# EAGLE design EHcircuit_v2.1 (EAGLE 9.1.0)
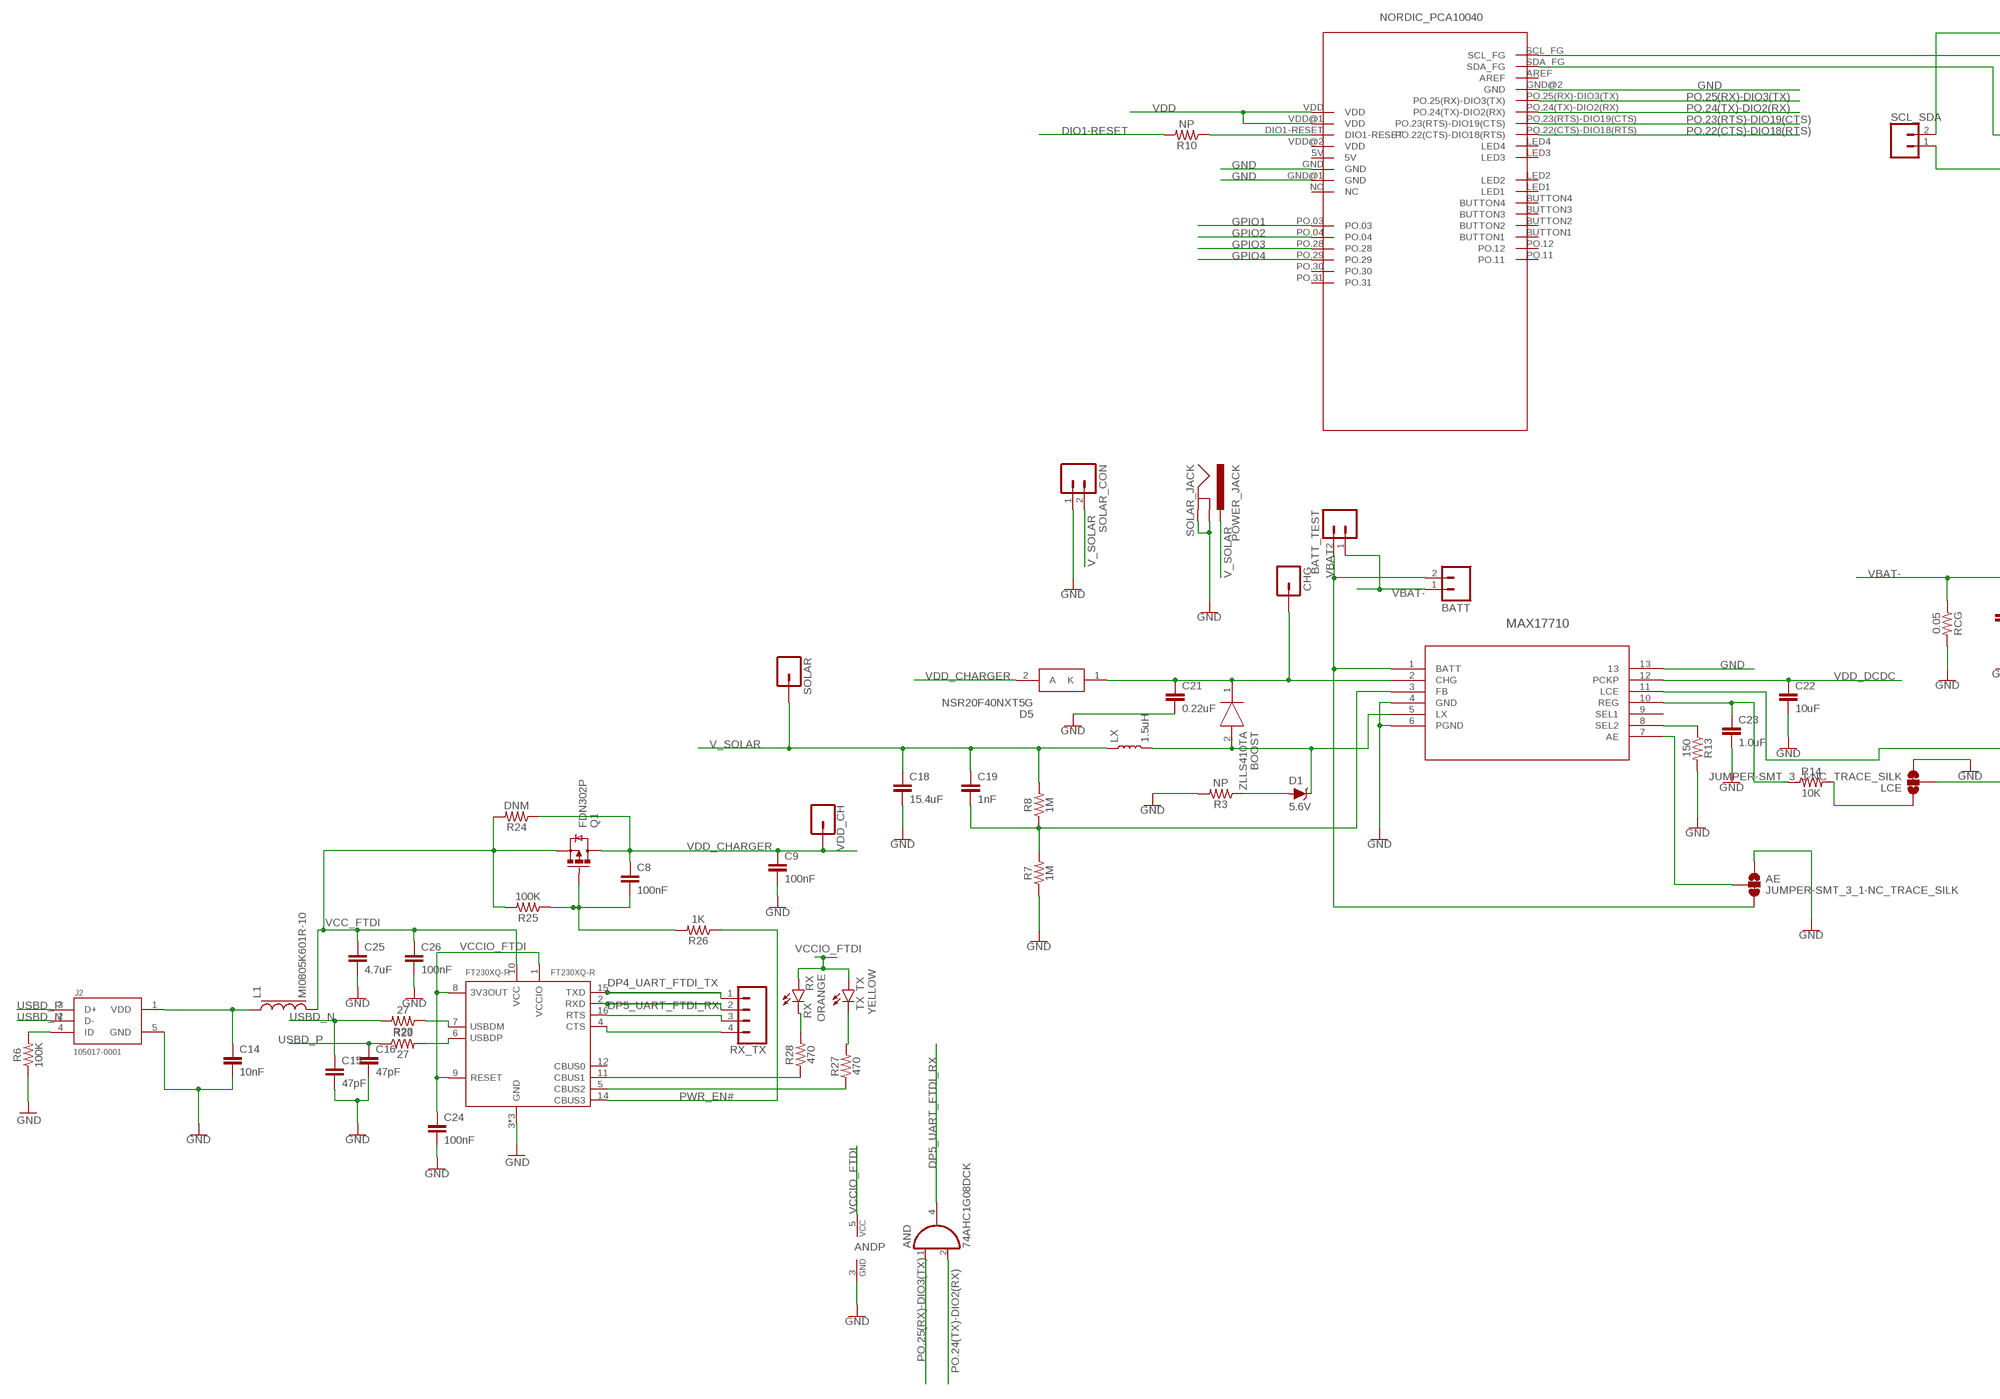
[diagram p0: schematic, sheet 1, part 1 of 2]
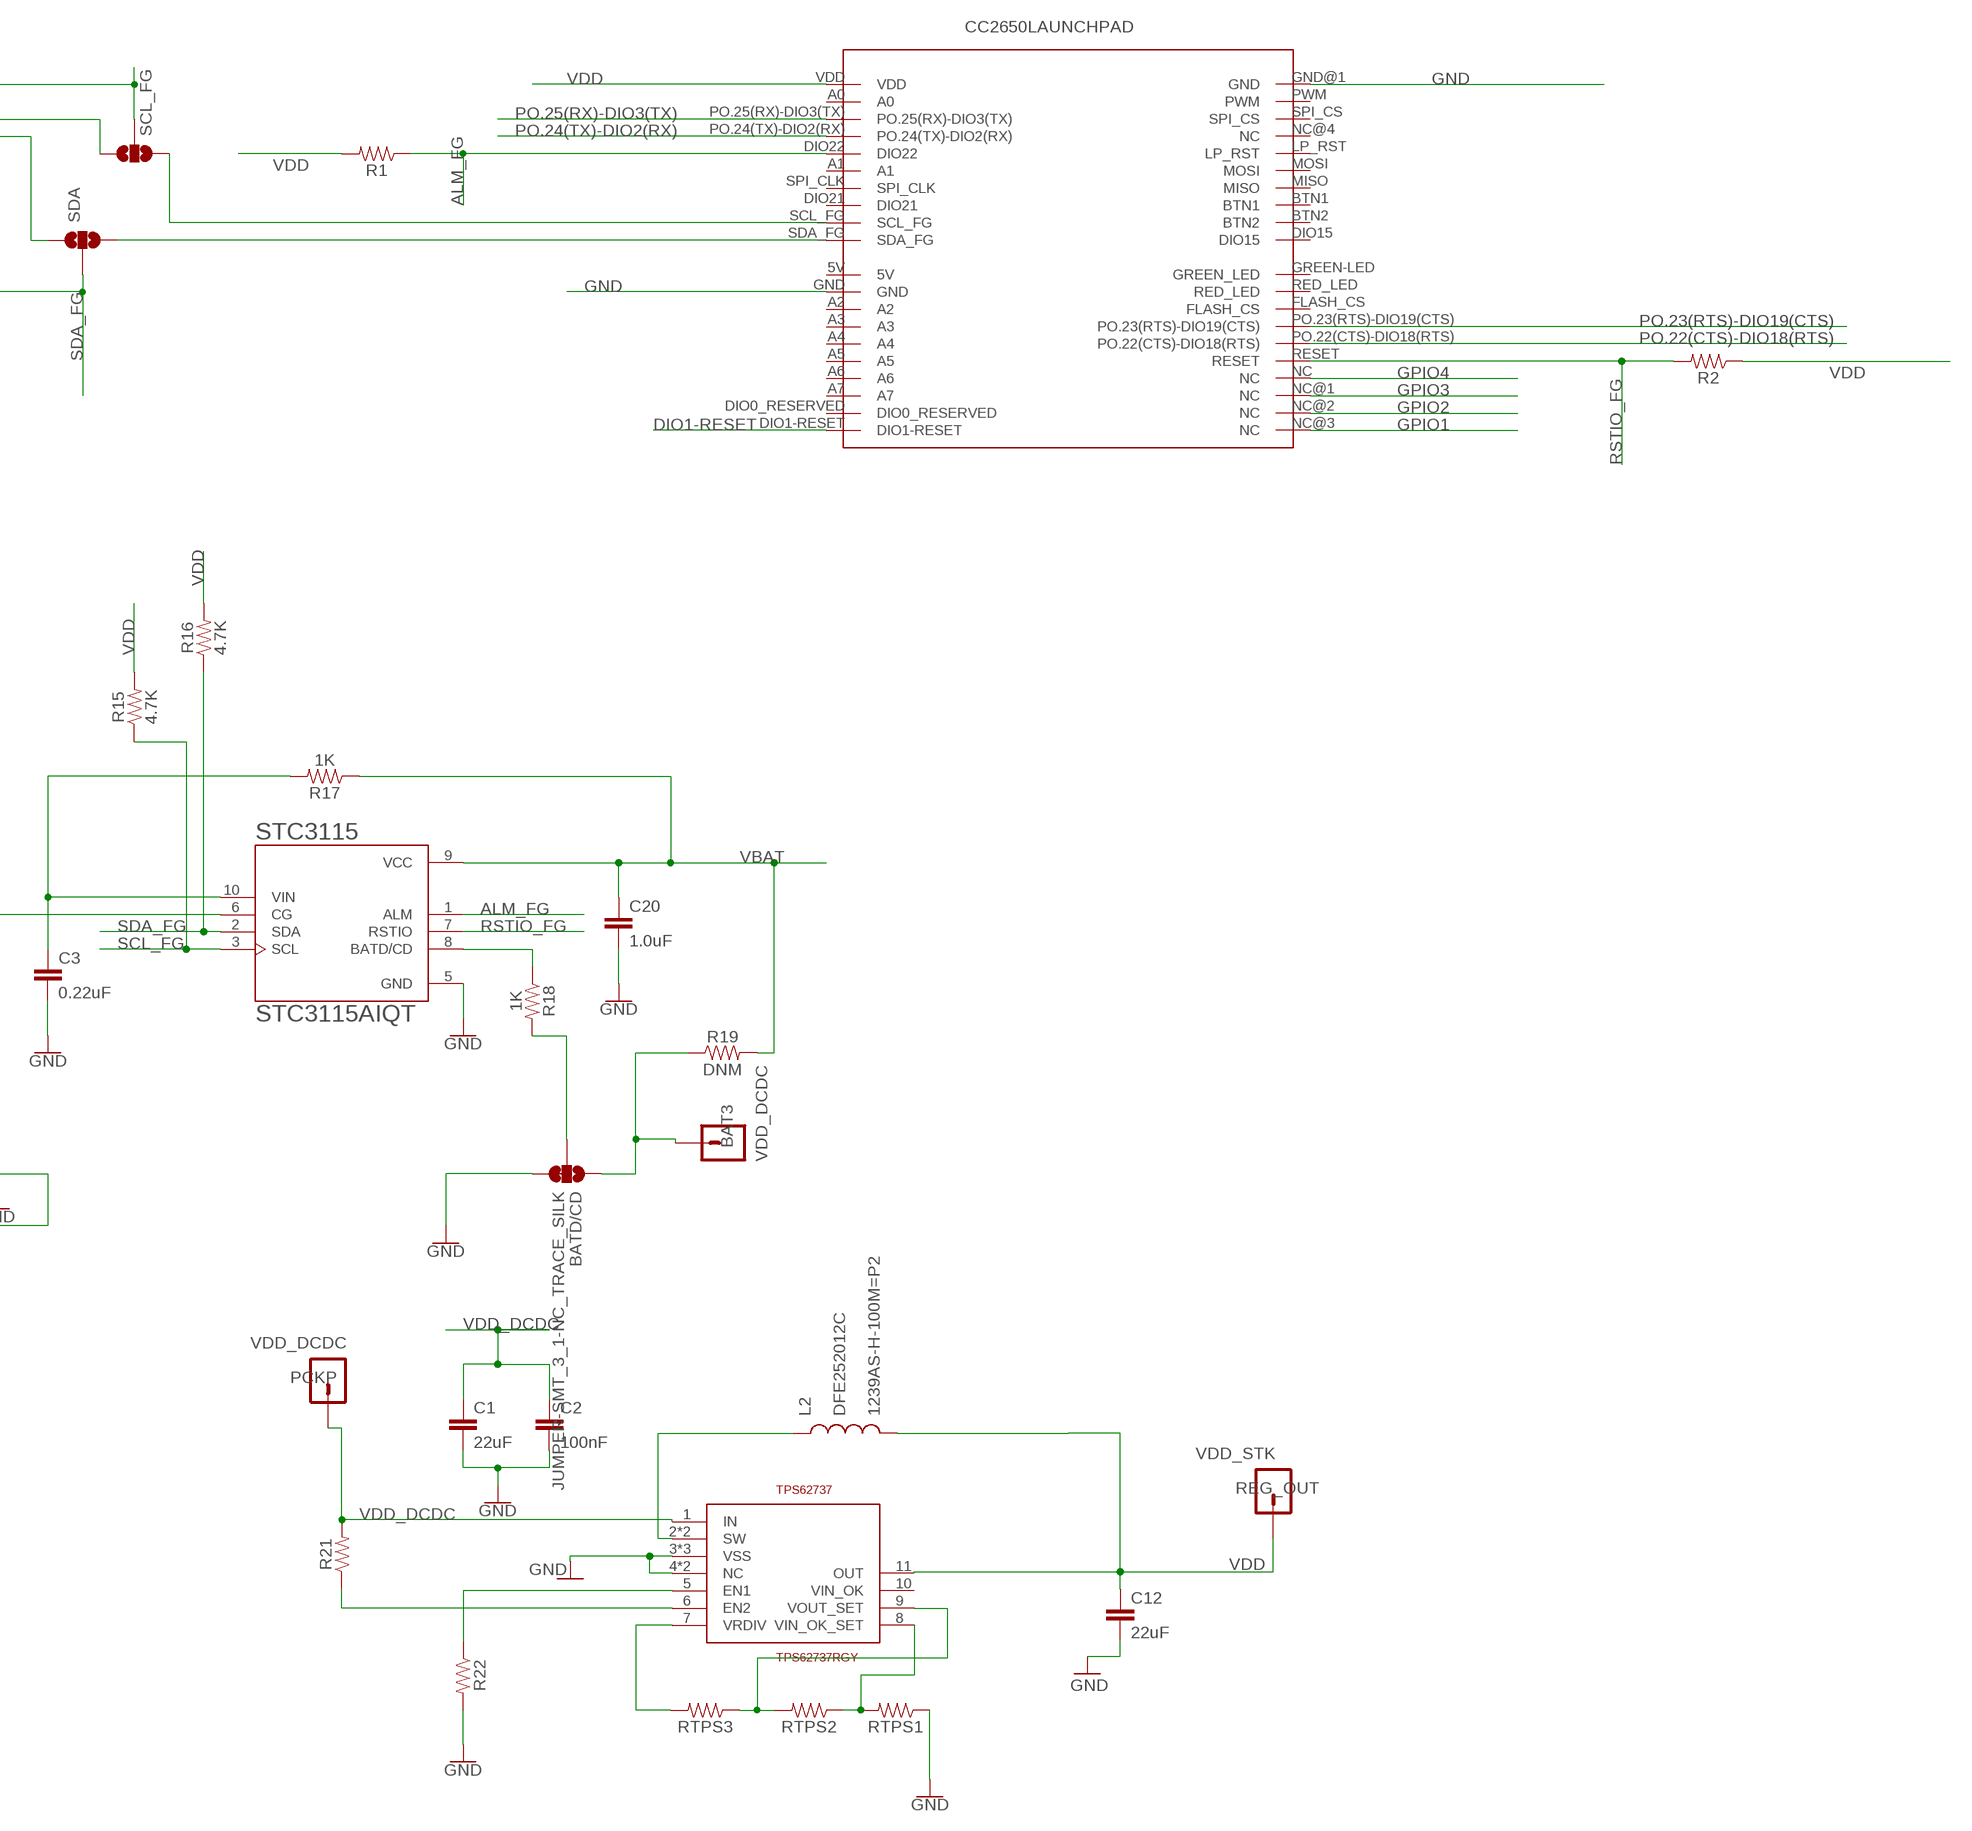
[diagram p1: schematic, sheet 1, part 2 of 2]

## Parts
AE  JUMPER-SMT_3_1-NC_TRACE_SILK  [SMT-JUMPER_3_1-NC_TRACE_SILK]
AND  74AHC1G08DCK  [SC70-5]
BAT3  M01PTH  [1X01@1]
BATD/CD  JUMPER-SMT_3_1-NC_TRACE_SILK  [SMT-JUMPER_3_1-NC_TRACE_SILK]
BATT  M02-JST-2MM-SMT  [JST-2-SMD@1]
BATT_TEST  M02PTH  [1X02@1]
BOOST  ZLLS410TA  [SOD2513X120N]
C1  22uF  10UF-0805-10V-10%  [0805]
C2  100nF  10UF-0805-10V-10%  [0805]
C3  0.22uF  10UF-0805-10V-10%  [0805]
C8  100nF  10UF-0805-10V-10%  [0805]
C9  100nF  10UF-0805-10V-10%  [0805]
C12  22uF  10UF-0805-10V-10%  [0805]
C14  10nF  10UF-0805-10V-10%  [0805]
C15  47pF  10UF-0805-10V-10%  [0805]
C16  47pF  10UF-0805-10V-10%  [0805]
C18  15.4uF  10UF-0805-10V-10%  [0805]
C19  1nF  10UF-0805-10V-10%  [0805]
C20  1.0uF  10UF-0805-10V-10%  [0805]
C21  0.22uF  10UF-0805-10V-10%  [0805]
C22  10uF  10UF-0805-10V-10%  [0805]
C23  1.0uF  10UF-0805-10V-10%  [0805]
C24  100nF  10UF-0805-10V-10%  [0805]
C25  4.7uF  10UF-0805-10V-10%  [0805]
C26  100nF  10UF-0805-10V-10%  [0805]
CHG  M01PTH  [1X01@1]
D1  5.6V  DIODE-ZENER-MMSZ5232BS  [SOD-323]
D5  NSR20F40NXT5G  [DSN2_1]
FT230XQ-R  FT230XQ-R  FT230XQ_2  [QFN16]
J2  105017-0001  [MOLEX_105017-0001]
L1  MI0805K601R-10  FERRITE_BREAD  [0805]
L2  1239AS-H-100M=P2  DFE252012C  [DFE252012C]
LCE  JUMPER-SMT_3_1-NC_TRACE_SILK  [SMT-JUMPER_3_1-NC_TRACE_SILK]
LX  1.5uH  LQM2HPN1R5MG0L  [INDC2520X100]
MAX17710  MAX17710  MAX17710GB+T  [21-0451C]
PCKP  M01PTH  [1X01@1]
Q1  FDN302P  [SOT23-3]
R1  0.3OHM-0805-1/8W-1%  [0805]
R2  0.3OHM-0805-1/8W-1%  [0805]
R3  NP  0.3OHM-0805-1/8W-1%  [0805]
R6  100K  0.3OHM-0805-1/8W-1%  [0805]
R7  1M  0.3OHM-0805-1/8W-1%  [0805]
R8  1M  0.3OHM-0805-1/8W-1%  [0805]
R10  NP  0.3OHM-0805-1/8W-1%  [0805]
R13  150  0.3OHM-0805-1/8W-1%  [0805]
R14  10K  0.3OHM-0805-1/8W-1%  [0805]
R15  4.7K  0.3OHM-0805-1/8W-1%  [0805]
R16  4.7K  0.3OHM-0805-1/8W-1%  [0805]
R17  1K  0.3OHM-0805-1/8W-1%  [0805]
R18  1K  0.3OHM-0805-1/8W-1%  [0805]
R19  DNM  0.3OHM-0805-1/8W-1%  [0805]
R21  0.3OHM-0805-1/8W-1%  [0805]
R22  0.3OHM-0805-1/8W-1%  [0805]
R23  27  0.3OHM-0805-1/8W-1%  [0805]
R24  DNM  0.3OHM-0805-1/8W-1%  [0805]
R25  100K  0.3OHM-0805-1/8W-1%  [0805]
R26  1K  0.3OHM-0805-1/8W-1%  [0805]
R27  470  0.3OHM-0805-1/8W-1%  [0805]
R28  470  0.3OHM-0805-1/8W-1%  [0805]
R29  27  0.3OHM-0805-1/8W-1%  [0805]
RB2  CC2650LAUNCHPAD  [SEPS_RB]
RCG  0.05  0.3OHM-0805-1/8W-1%  [0805]
REG_OUT  M01PTH  [1X01@1]
RTPS1  0.3OHM-0805-1/8W-1%  [0805]
RTPS2  0.3OHM-0805-1/8W-1%  [0805]
RTPS3  0.3OHM-0805-1/8W-1%  [0805]
RX  ORANGE  LED0603  [LED-0603]
RX_TX  CONN_04  [1X04]
SCL  JUMPER-SMT_3_0_SILK  [SMT-JUMPER_3_0_NC_TRACE_SILK]
SCL_SDA  CONN_02  [1X02]
SDA  JUMPER-SMT_3_0_SILK  [SMT-JUMPER_3_0_NC_TRACE_SILK]
SOLAR  M01PTH  [1X01@1]
SOLAR_CON  M023.5MM  [SCREWTERMINAL-3.5MM-2@1]
SOLAR_JACK  POWER_JACK  [POWER_JACK_PTH]
STC3115  STC3115AIQT  [SON50P200X300X60-10]
TPS62737  TPS62737RGY  [QFN14]
TX  YELLOW  LED0603  [LED-0603]
U$1  PCA10040NORDIC  [SEPS_BB]
VDD_CH  CONN_01  [1X01]

## Nets
ALM_FG: R1.1 RB2.DIO22 STC3115.1(ALM)
DIO1-RESET: R10.2 RB2.DIO1-RESET
DP4_UART_FTDI_TX: FT230XQ-R.15(TXD) RX_TX.1
DP5_UART_FTDI_RX: AND.4(O) FT230XQ-R.2(RXD) RX_TX.2
GND: AE.1 AND.3(GND) BATD/CD.3 C1.2 C2.2 C3.2 C9.2 C12.2 C14.2 C15.2 C16.2 C18.2 C20.2 C21.2 C22.2 C23.2 C24.2 C25.2 C26.2 FT230XQ-R.3(GND) FT230XQ-R.13(GND) FT230XQ-R.17(GND) J2.5(GND) LCE.3 MAX17710.4(GND) MAX17710.6(PGND) MAX17710.13 R3.2 R6.1 R7.1 R13.2 R22.2 RB2.GND RB2.GND@1(GND) RCG.2 RTPS1.1 SOLAR_CON.1 SOLAR_JACK.GND SOLAR_JACK.GNDBREAK STC3115.5(GND) TPS62737.3(VSS) TPS62737.4(NC) TPS62737.12(VSS) TPS62737.14(NC) TPS62737.TH_PAD(VSS) U$1.GND U$1.GND@1(GND) U$1.GND@2(GND)
GPIO1: RB2.NC@3(NC) U$1.PO.03
GPIO2: RB2.NC@2(NC) U$1.PO.04
GPIO3: RB2.NC@1(NC) U$1.PO.28
GPIO4: RB2.NC U$1.PO.29
N$1: FT230XQ-R.11(CBUS1) R28.1
N$2: C14.1 J2.1(VDD) L1.1
N$3: C8.2 Q1.1(G) R25.1 R26.2
N$4: RTPS1.2 RTPS2.1 TPS62737.8(VIN_OK_SET)
N$5: R18.1 STC3115.8(BATD/CD)
N$6: R22.1 TPS62737.5(EN1)
N$7: BOOST.2(A) D1.C LX.2 MAX17710.5(LX)
N$9: C19.2 MAX17710.3(FB) R7.2 R8.1
N$10: R21.1 TPS62737.6(EN2)
N$11: L2.P$1 TPS62737.2(SW) TPS62737.13(SW)
N$12: RB2.SCL_FG SCL.1
N$13: C23.1 MAX17710.10(REG) R14.1
N$14: FT230XQ-R.5(CBUS2) R27.1
N$15: LCE.2 MAX17710.11(LCE)
N$16: MAX17710.8(SEL2) R13.1
N$17: LCE.1 R14.2
N$18: J2.4(ID) R6.2
N$19: AE.2 MAX17710.7(AE)
N$20: R28.2 RX.C
N$21: R10.1 U$1.DIO1-RESET
N$22: RTPS3.2 TPS62737.7(VRDIV)
N$23: RB2.SDA_FG SDA.3
N$24: R27.2 TX.C
N$25: BATD/CD.2 R18.2
N$26: RTPS2.2 RTPS3.1 TPS62737.9(VOUT_SET)
N$27: SDA.1 U$1.SDA_FG
N$28: SCL.3 U$1.SCL_FG
N$29: BAT3.1 BATD/CD.1 R19.1
N$30: BOOST.1(K) C21.1 CHG.1 D5.1(K) MAX17710.2(CHG)
N$31: FT230XQ-R.7(USBDM) R23.1
N$32: FT230XQ-R.6(USBDP) R29.2
N$33: FT230XQ-R.16(RTS) RX_TX.3
N$34: C3.1 R17.2 STC3115.10(VIN)
N$35: FT230XQ-R.4(CTS) RX_TX.4
N$36: D1.A R3.1
PO.22(CTS)-DIO18(RTS): RB2.PO.22(CTS)-DIO18(RTS) U$1.PO.22(CTS)-DIO18(RTS)
PO.23(RTS)-DIO19(CTS): RB2.PO.23(RTS)-DIO19(CTS) U$1.PO.23(RTS)-DIO19(CTS)
PO.24(TX)-DIO2(RX): AND.2(I1) RB2.PO.24(TX)-DIO2(RX) U$1.PO.24(TX)-DIO2(RX)
PO.25(RX)-DIO3(TX): AND.1(I0) RB2.PO.25(RX)-DIO3(TX) U$1.PO.25(RX)-DIO3(TX)
PWR_EN#: FT230XQ-R.14(CBUS3) R26.1
RSTIO_FG: R2.2 RB2.RESET STC3115.7(RSTIO)
SCL_FG: R15.1 SCL.2 SCL_SDA.2 STC3115.3(SCL)
SDA_FG: R16.1 SCL_SDA.1 SDA.2 STC3115.2(SDA)
USBD_N: C15.1 J2.2(D-) R23.2
USBD_P: C16.1 J2.3(D+) R29.1
V_SOLAR: C18.1 C19.1 LX.1 R8.2 SOLAR.1 SOLAR_CON.2 SOLAR_JACK.PWR
VBAT: AE.3 BATT.2 BATT_TEST.2 C20.1 MAX17710.1(BATT) R17.1 R19.2 STC3115.9(VCC)
VBAT-: BATT.1 BATT_TEST.1 RCG.1 STC3115.6(CG)
VCC_FTDI: C25.1 C26.1 FT230XQ-R.10(VCC) L1.2 Q1.2(S) R24.2 R25.2
VCCIO_FTDI: AND.5(VCC) C24.1 FT230XQ-R.1(VCCIO) FT230XQ-R.8(3V3OUT) FT230XQ-R.9(RESET) RX.A TX.A
VDD: C12.1 L2.P$2 R1.2 R2.1 R15.2 R16.2 RB2.VDD REG_OUT.1 TPS62737.11(OUT) U$1.VDD U$1.VDD@1(VDD)
VDD_CHARGER: C8.1 C9.1 D5.2(A) Q1.3(D) R24.1 VDD_CH.1
VDD_DCDC: C1.1 C2.1 C22.1 MAX17710.12(PCKP) PCKP.1 R21.2 TPS62737.1(IN)
Unconnected: FT230XQ-R.12(CBUS0) MAX17710.9(SEL1) RB2.5V RB2.A0 RB2.A1 RB2.A2 RB2.A3 RB2.A4 RB2.A5 RB2.A6 RB2.A7 RB2.BTN1 RB2.BTN2 RB2.DIO0_RESERVED RB2.DIO15 RB2.DIO21 RB2.FLASH_CS RB2.GREEN-LED(GREEN_LED) RB2.LP_RST RB2.MISO RB2.MOSI RB2.NC@4(NC) RB2.PWM RB2.RED_LED RB2.SPI_CLK RB2.SPI_CS TPS62737.10(VIN_OK) U$1.5V U$1.AREF U$1.BUTTON1 U$1.BUTTON2 U$1.BUTTON3 U$1.BUTTON4 U$1.LED1 U$1.LED2 U$1.LED3 U$1.LED4 U$1.NC U$1.PO.11 U$1.PO.12 U$1.PO.30 U$1.PO.31 U$1.VDD@2(VDD)

## Library data of the parts
AE BATD/CD LCE = SparkFun-Jumpers:JUMPER-SMT_3_1-NC_TRACE: Normally closed trace jumper (1 of 2 connections) This jumper has a trace between two pads so it's normally closed (NC). The other connection is normally open (NO). Use a razor knife to open the connection. For best results follow the IPC guidelines for cutting traces: Cutout at least 0.063 mm (0.005 in). Remove all loose material to clean up the cut area. Seal the cut with an approved epoxy. Reapply solder to reclose the connection, or to close the NO connection.
AND = 74xx-little-de:74*1G08: 2-input AND gate
BAT3 PCKP = SparkFun-Connectors:M01: Header 1 Standard 1-pin 0.1" header. Use with straight break away headers (SKU : PRT-00116), right angle break away headers (PRT-00553), swiss pins (PRT-00743), machine pins (PRT-00117), and female headers (PRT-00115). SMTSO-256-ET is a "flush mount" nut for a 4-40 screw. The older package used to be too tight, and did not allow it to sit properly thru the drill hit. The latest (0.165DIA) fits nice and snug.; LABEL: VDD_DCDC
BATT = SparkFun-Connectors:M02: Standard 2-pin 0.1" header. Use with - straight break away headers ( PRT-00116) - right angle break away headers (PRT-00553) - swiss pins (PRT-00743) - machine pins (PRT-00117) - female headers (PRT-00115) Molex polarized connector foot print use with: PRT-08233 with associated crimp pins and housings. 2.54_SCREWTERM for use with PRT-10571. 3.5mm Screw Terminal footprints for PRT-08084 5mm Screw Terminal footprints for use with PRT-08432; PROD_ID: CONN-11443
BATT_TEST = SparkFun-Connectors:M02: Standard 2-pin 0.1" header. Use with - straight break away headers ( PRT-00116) - right angle break away headers (PRT-00553) - swiss pins (PRT-00743) - machine pins (PRT-00117) - female headers (PRT-00115) Molex polarized connector foot print use with: PRT-08233 with associated crimp pins and housings. 2.54_SCREWTERM for use with PRT-10571. 3.5mm Screw Terminal footprints for PRT-08084 5mm Screw Terminal footprints for use with PRT-08432
BOOST = ZLLS410TA:ZLLS410TA: Diodes Inc ZLLS410TA, SMT Schottky Diode, 10V 750mA, 3ns, 2-Pin SOD-323 Source: Datasheet <http://uk.rs-online.com/web/p/products/1221249>; ARROW_PART_NUMBER: ZLLS410TA; ARROW_PRICE/STOCK: https://www.arrow.com/en/products/zlls410ta/diodes-incorporated; DESCRIPTION: Diodes Inc ZLLS410TA, SMT Schottky Diode, 10V 750mA, 3ns, 2-Pin SOD-323; HEIGHT: 1.2mm; MANUFACTURER_NAME: Diodes Inc.; MANUFACTURER_PART_NUMBER: ZLLS410TA; RS_PART_NUMBER: 1221249; RS_PRICE/STOCK: http://uk.rs-online.com/web/p/products/1221249
C1-C3 C8 C9 C12 C14-C16 C18-C21 C23-C26 = SparkFun-Capacitors:10UF: 10.0µF ceramic capacitors A capacitor is a passive two-terminal electrical component used to store electrical energy temporarily in an electric field.; PROD_ID: CAP-11330; VALUE: 10uF
C22 = SparkFun-Capacitors:10UF: 10.0µF ceramic capacitors A capacitor is a passive two-terminal electrical component used to store electrical energy temporarily in an electric field.; PROD_ID: CAP-11330
CHG SOLAR = SparkFun-Connectors:M01: Header 1 Standard 1-pin 0.1" header. Use with straight break away headers (SKU : PRT-00116), right angle break away headers (PRT-00553), swiss pins (PRT-00743), machine pins (PRT-00117), and female headers (PRT-00115). SMTSO-256-ET is a "flush mount" nut for a 4-40 screw. The older package used to be too tight, and did not allow it to sit properly thru the drill hit. The latest (0.165DIA) fits nice and snug.
D1 = SparkFun-DiscreteSemi:DIODE-ZENER: Zener Diode A Zener diode allows current to flow from its anode to its cathode like a normal semiconductor diode, but it also permits current to flow in the reverse direction when its "Zener voltage" is reached. - WIkipedia; PROD_ID: DIO-12442
D5 = NSR20F40NXT5G:NSR20F40NXT5G: DSN2 0603 Schottky Diode 40V 2A Source: Datasheet <http://www.onsemi.com/pub/Collateral/NSR20F40-D.PDF>; ARROW_PART_NUMBER: NSR20F40NXT5G; ARROW_PRICE/STOCK: https://www.arrow.com/en/products/nsr20f40nxt5g/on-semiconductor; DESCRIPTION: DSN2 0603 Schottky Diode 40V 2A; HEIGHT: mm; MANUFACTURER_NAME: ON Semiconductor; MANUFACTURER_PART_NUMBER: NSR20F40NXT5G
FT230XQ-R = FT230XQ:FT230XQ_2
J2 = 105017-0001:105017-0001; AVAILABILITY: Good; DESCRIPTION: Conn USB Type B M 5 POS 0.65mm Solder RA Thru-Hole 5 Terminal 1 Port Embossed T/R; MF: Molex; MP: 105017-0001; PACKAGE: None; PRICE: 0.49 USD
L1 = davide:FERRITE_BREAD
L2 = davide:DFE252012C; MODEL: DFE252012C
LX = INDC2520X100:LQM2HPN1R5MG0L: Inductor Murata Electronics North America LQM2HPN1R5MG0L‎
MAX17710 = MAX17710:MAX17710GB+T; MANUFACTURER_NAME: Maxi17710; MANUFACTURER_PART_NUMBER: MAX17710GB+T; VENDOR: Maxim
Q1 = davide:FDN302P
R1-R3 R6-R8 R10 R13-R19 R21-R29 RCG RTPS1-RTPS3 = SparkFun-Resistors:0.3OHM: 0.3Ω resistor A resistor is a passive two-terminal electrical component that implements electrical resistance as a circuit element. Resistors act to reduce current flow, and, at the same time, act to lower voltage levels within circuits. - Wikipedia; PROD_ID: RES-11622; VALUE: 0.3
RB2 = powersol:CC2650LAUNCHPAD: CC2650 LaunchPad
REG_OUT = SparkFun-Connectors:M01: Header 1 Standard 1-pin 0.1" header. Use with straight break away headers (SKU : PRT-00116), right angle break away headers (PRT-00553), swiss pins (PRT-00743), machine pins (PRT-00117), and female headers (PRT-00115). SMTSO-256-ET is a "flush mount" nut for a 4-40 screw. The older package used to be too tight, and did not allow it to sit properly thru the drill hit. The latest (0.165DIA) fits nice and snug.; LABEL: VDD_STK
RX = SparkFun-LED:LED: LED (Generic) Standard schematic elements and footprints for 5mm, 3mm, 1206, and 0603 sized LEDs. Generic LEDs with no color specified.; COLOR: ORANGE; FUNCTION: RX
RX_TX = SparkFun-Connectors:CONN_04: Multi connection point. Often used as Generic Header-pin footprint for 0.1 inch spaced/style header connections On any of the 0.1 inch spaced packages, you can populate with these: Break Away Headers - Straight <https://www.sparkfun.com/products/116> (PRT-00116) Break Away Male Headers - Right Angle <https://www.sparkfun.com/products/553> (PRT-00553) Female Headers <https://www.sparkfun.com/products/115> (PRT-00115) Break Away Headers - Machine Pin <https://www.sparkfun.com/products/117> (PRT-00117) Break Away Female Headers - Swiss Machine Pin <https://www.sparkfun.com/products/743> (PRT-00743) For SCREWTERMINALS and SPRING TERMINALS visit here: Screw Terimnals on SparkFun.com <https://www.sparkfun.com/search/results?term=Screw+Terminals> (5mm/3.5mm/2.54mm spacing) This device is also useful as a general connection point to wire up your design to another part of your project. Our various solder wires solder well into these plated through hole pads. Hook-Up Wire - Assortment (Stranded, 22 AWG) <https://www.sparkfun.com/products/11375> (PRT-11375) Hook-Up Wire - Assortment (Solid Core, 22 AWG) <https://www.sparkfun.com/products/11367> (PRT-11367) View the entire wire category on our website here <https://www.sparkfun.com/categories/141> Special notes: Molex polarized connector foot print use with SKU : PRT-08231 with associated crimp pins and housings. 1MM SMD Version SKU: PRT-10208; PROD_ID: CONN-09696
SCL SDA = powersol:JUMPER-SMT_3_0_SILK
SCL_SDA = SparkFun-Connectors:CONN_02: Multi connection point. Often used as Generic Header-pin footprint for 0.1 inch spaced/style header connections On any of the 0.1 inch spaced packages, you can populate with these: Break Away Headers - Straight <https://www.sparkfun.com/products/116> (PRT-00116) Break Away Male Headers - Right Angle <https://www.sparkfun.com/products/553> (PRT-00553) Female Headers <https://www.sparkfun.com/products/115> (PRT-00115) Break Away Headers - Machine Pin <https://www.sparkfun.com/products/117> (PRT-00117) Break Away Female Headers - Swiss Machine Pin <https://www.sparkfun.com/products/743> (PRT-00743) For SCREWTERMINALS and SPRING TERMINALS visit here: Screw Terimnals on SparkFun.com <https://www.sparkfun.com/search/results?term=Screw+Terminals> (5mm/3.5mm/2.54mm spacing) This device is also useful as a general connection point to wire up your design to another part of your project. Our various solder wires solder well into these plated through hole pads. Hook-Up Wire - Assortment (Stranded, 22 AWG) <https://www.sparkfun.com/products/11375> (PRT-11375) Hook-Up Wire - Assortment (Solid Core, 22 AWG) <https://www.sparkfun.com/products/11367> (PRT-11367) View the entire wire category on our website here <https://www.sparkfun.com/categories/141> Special notes: Molex polarized connector foot print use with: PRT-08233 with associated crimp pins and housings. 2.54_SCREWTERM for use with PRT-10571. 3.5mm Screw Terminal footprints for PRT-08084 5mm Screw Terminal footprints for use with PRT-08432
SOLAR_CON = SparkFun-Connectors:M02: Standard 2-pin 0.1" header. Use with - straight break away headers ( PRT-00116) - right angle break away headers (PRT-00553) - swiss pins (PRT-00743) - machine pins (PRT-00117) - female headers (PRT-00115) Molex polarized connector foot print use with: PRT-08233 with associated crimp pins and housings. 2.54_SCREWTERM for use with PRT-10571. 3.5mm Screw Terminal footprints for PRT-08084 5mm Screw Terminal footprints for use with PRT-08432; PROD_ID: CONN-08399
SOLAR_JACK = SparkFun-Connectors:POWER_JACK: Power Jack Connector This is the standard 5.5mm barrel jack for power. The PTH is the most common, proven, reliable, footprint. The Slot footprint only works if the mill layer is transmitted to the PCB fab house so be warned. Here are the connectors we sell at SparkFun: DC Barrel Power Jack/Connector <https://www.sparkfun.com/products/119> (PRT-00119) DC Barrel Power Jack/Connector (SMD) <https://www.sparkfun.com/products/12748> (PRT-12748) DC Barrel Jack Adapter - Breadboard Compatible <https://www.sparkfun.com/products/10811> (PRT-10811) It is used on this SparkFun product (and many, many others): SparkFun RedBoard - Programmed with Arduino <https://www.sparkfun.com/products/12757> (DEV-12757) Also, if you need a mating power supply or connector, please check these out: Wall Adapter Power Supply - 9VDC 650mA <https://www.sparkfun.com/products/298> (TOL-00298) DC Barrel Jack Adapter - Male <https://www.sparkfun.com/products/10287> (PRT-10287); PROD_ID: CONN-08197
STC3115 = STC3115AIQT:STC3115AIQT: STC3115 2.7 V -4.5 V Series Gas gauge IC alarm out for handheld apps-10-DFN; AVAILABILITY: Good; DESCRIPTION: STC3115 2.7 V -4.5 V Series Gas gauge IC alarm out for handheld apps-10-DFN; MF: STMicroelectronics; MP: STC3115AIQT; PACKAGE: DFN-10 STMicroelectronics; PRICE: 1.70 USD
TPS62737 = davide:TPS62737RGY
TX = SparkFun-LED:LED: LED (Generic) Standard schematic elements and footprints for 5mm, 3mm, 1206, and 0603 sized LEDs. Generic LEDs with no color specified.; COLOR: YELLOW; FUNCTION: TX
U$1 = powersol:PCA10040NORDIC: Blue Board
VDD_CH = SparkFun-Connectors:CONN_01: Single connection point. Often used as Generic Header-pin footprint for 0.1 inch spaced/style header connections On any of the 0.1 inch spaced packages, you can populate with these: Break Away Headers - Straight <https://www.sparkfun.com/products/116> (PRT-00116) Break Away Male Headers - Right Angle <https://www.sparkfun.com/products/553> (PRT-00553) Female Headers <https://www.sparkfun.com/products/115> (PRT-00115) Break Away Headers - Machine Pin <https://www.sparkfun.com/products/117> (PRT-00117) Break Away Female Headers - Swiss Machine Pin <https://www.sparkfun.com/products/743> (PRT-00743) This device is also useful as a general connection point to wire up your design to another part of your project. Our various solder wires solder well into these plated through hole pads. Hook-Up Wire - Assortment (Stranded, 22 AWG) <https://www.sparkfun.com/products/11375> (PRT-11375) Hook-Up Wire - Assortment (Solid Core, 22 AWG) <https://www.sparkfun.com/products/11367> (PRT-11367) View the entire wire category on our website here <https://www.sparkfun.com/categories/141> Special notes: SMTSO-256-ET is a "flush mount" nut for a 4-40 screw. We mostly use this on specialty testbeds; it is a nice way to connect hardware to your PCB at an adjustable hieght. Also note, the SNAP packages are for using a snappable style connector. We sell a baggie of snaps and they are also used on two LilyPad designs: Snap Assortment - 30 pack (male and female) <https://www.sparkfun.com/products/11347> (DEV-11347) LilyPad Arduino SimpleSnap <https://www.sparkfun.com/products/10941> (DEV-10941) LilyPad SimpleSnap Protoboard <https://www.sparkfun.com/products/10940> (DEV-10940)

## Board
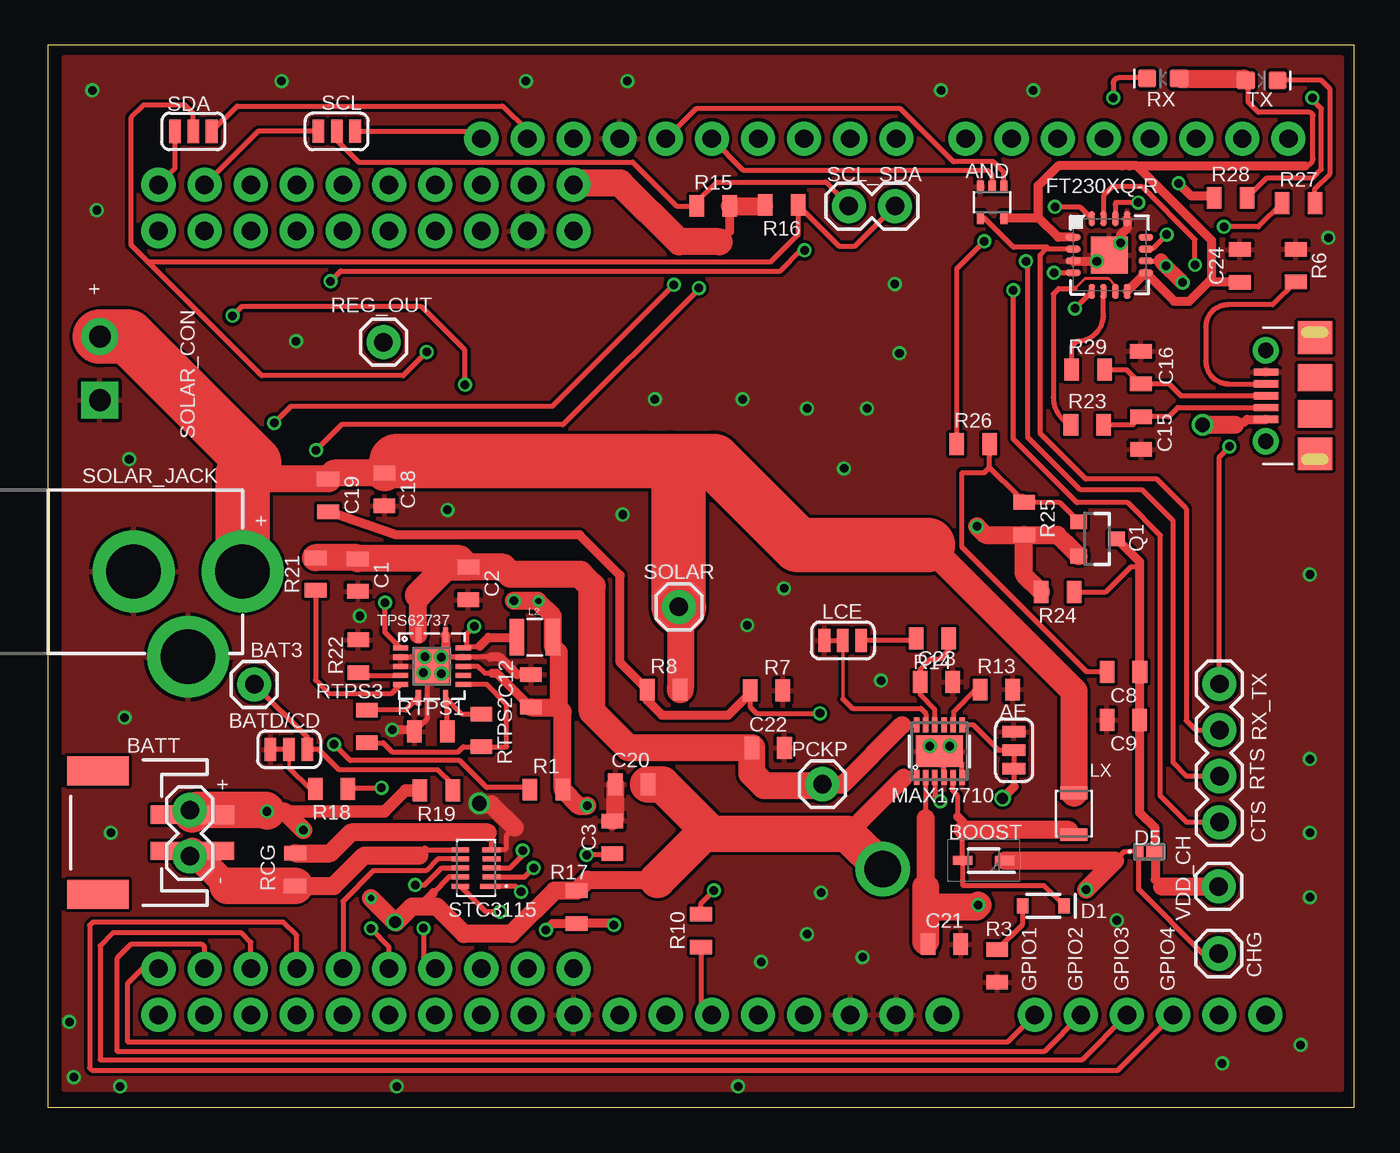
[diagram p2: board, top side]
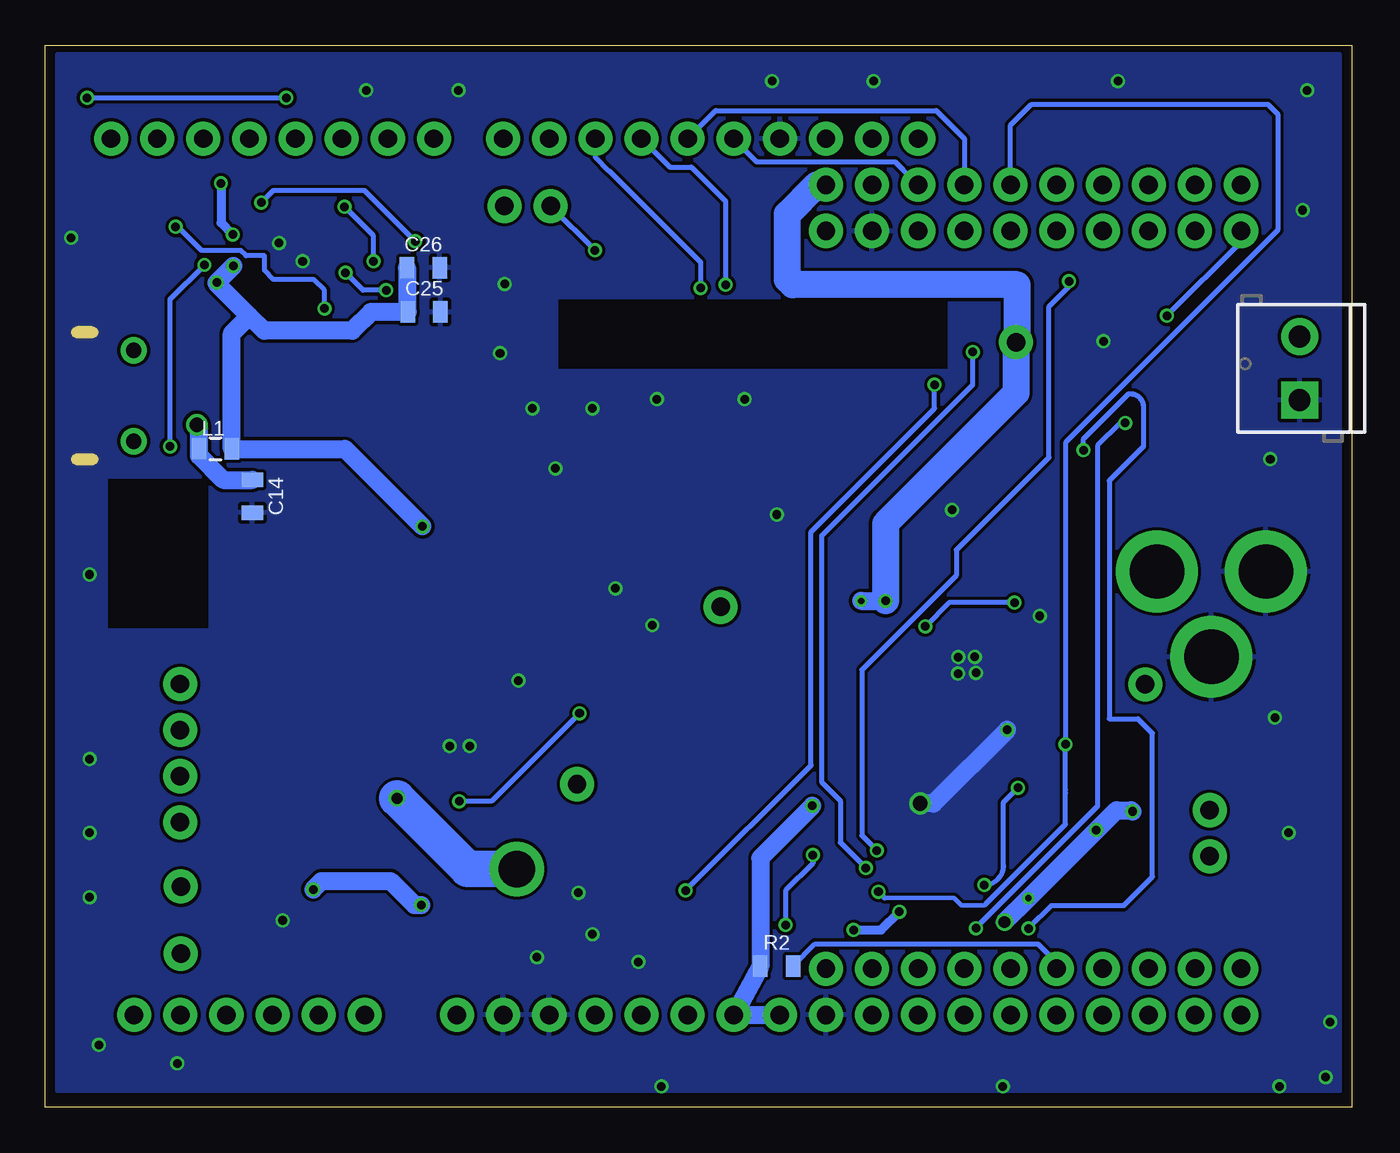
[diagram p3: board, bottom side, seen from below]

Size 71.94 x 58.48 mm. Coordinates in mm from the lower left corner, seen from the top.
Outline: 0,0 71.94,0 71.94,58.48 0,58.48 0,0
Copper layers (1*16): Top 0.018mm / dielectric 1.55mm / Bottom 0.018mm
Design rules "eC_2Layer_PClass5_BaseCopperO18": minimum track width 0.175mm, minimum drill 0.35mm, track to track 0.175mm, track to pad 0.175mm, pad to pad 0.175mm, via to via 0.175mm, smd to smd 0mil, copper to edge 0.25mm, drill to drill 0.35mm, minimum pad ring 0.2mm, minimum via ring 0.15mm, stop-mask expansion 0mil, vias tented up to drill 0.45mm, thermal gap 0.2mm

### Footprints (pad centres in the part's own frame; a part is rotated, then mirrored left to right if it is on the bottom)
SMT-JUMPER_3_1-NC_TRACE_SILK = smd 0.635 x 1.27: 1 -1.016,0; 2 0,0; 3 1.016,0
SC70-5 = smd 0.4 x 0.7: 1 -0.65,-0.85; 2 0,-0.85; 3 0.65,-0.85; 4 0.65,0.85; 5 -0.65,0.85
1X01@1 = drill 1.016 pad 1.88: 1 0,0
JST-2-SMD@1 = smd 1 x 4.6: 1 -1,-3.7; 2 1,-3.7 | smd 1.6 x 3.4: NC1 -3.4,1.5; NC2 3.4,1.5
1X02@1 = drill 1.016 pad 1.88: 1 0,0; 2 2.54,0
SOD2513X120N = smd 1.075 x 0.5: 1 -1.162,0; 2 1.162,0
0805 = smd 0.8 x 1.2: 1 -0.9,0; 2 0.9,0
SOD-323 = smd 0.63 x 0.83: A 1.15,0; C -1.15,0
DSN2_1 = smd 0.52 x 0.7: 1 -0.59,0 | smd 0.953 x 0.7: 2 0.325,0
QFN16 = smd 0.8 x 0.35: 1 -2,0.975; 2 -2,0.325; 3 -2,-0.325; 4 -2,-0.975; 9 2,-0.975; 10 2,-0.325; 11 2,0.325; 12 2,0.975 | smd 0.35 x 0.8: 5 -0.975,-2; 6 -0.325,-2; 7 0.325,-2; 8 0.975,-2; 13 0.975,2; 14 0.325,2; 15 -0.325,2; 16 -0.975,2 | smd 2.032 x 2.032: 17 0,0
MOLEX_105017-0001 = smd 0.4 x 1.35: 1 -1.3,2.675; 2 -0.65,2.675; 3 0,2.675; 4 0.65,2.675; 5 1.3,2.675 | drill 0.85 pad 1.45: P$1 -2.5,2.7; P$2 2.5,2.7 | smd 1.5 x 1.9: P$8 -1,0; P$9 1,0 | smd 1.8 x 1.9: P$10 -3.2,0; P$11 3.2,0
DFE252012C = smd 0.8 x 2: P$1 -1,0; P$2 1,0
INDC2520X100 = smd 0.7 x 1.5: 1 -1.15,0; 2 1.15,0
21-0451C = smd 0.813 x 0.305: 1 -1.448,1.25; 2 -1.448,0.75; 3 -1.448,0.25; 4 -1.448,-0.25; 5 -1.448,-0.75; 6 -1.448,-1.25; 7 1.448,-1.25; 8 1.448,-0.75; 9 1.448,-0.25; 10 1.448,0.25; 11 1.448,0.75; 12 1.448,1.25 | smd 1.727 x 2.591: 13 0,0
SOT23-3 = smd 0.8 x 0.9: 1 -0.95,-1; 2 0.95,-1; 3 0,1.1
SEPS_RB = drill 1.016 pad 1.88: 5V -24.257,-22.225; A0 -21.717,-24.765; A1 -11.557,-24.765; A2 -19.177,-22.225; A3 -16.637,-22.225; A4 -14.097,-22.225; A5 -11.557,-22.225; A6 -9.017,-22.225; A7 -6.477,-22.225; BTN1 -6.477,20.955; BTN2 -3.937,20.955; DIO0_RESERVED -3.937,-22.225; DIO1-RESET -1.397,-22.225; DIO15 -1.397,20.955; DIO21 -6.477,-24.765; DIO22 -14.097,-24.765; FLASH_CS -19.177,18.415; GND -21.717,-22.225; GND@1 -24.257,20.955; GREEN-LED -24.257,18.415; LP_RST -14.097,20.955; MISO -9.017,20.955; MOSI -11.557,20.955; NC -9.017,18.415; NC@1 -6.477,18.415; NC@2 -3.937,18.415; NC@3 -1.397,18.415; NC@4 -16.637,20.955; PO.22(CTS)-DIO18(RTS) -14.097,18.415; PO.23(RTS)-DIO19(CTS) -16.637,18.415; PO.24(TX)-DIO2(RX) -16.637,-24.765; PO.25(RX)-DIO3(TX) -19.177,-24.765; PWM -21.717,20.955; RED_LED -21.717,18.415; RESET -11.557,18.415; SCL_FG -3.937,-24.765; SDA_FG -1.397,-24.765; SPI_CLK -9.017,-24.765; SPI_CS -19.177,20.955; VDD -24.257,-24.765
LED-0603 = smd 1 x 1: A -0.877,0; C 0.877,0
1X04 = drill 1.016 pad 1.88: 1 0,0; 2 2.54,0; 3 5.08,0; 4 7.62,0
SMT-JUMPER_3_0_NC_TRACE_SILK = smd 0.635 x 1.27: 1 -1.016,0; 2 0,0; 3 1.016,0
1X02 = drill 1.016 pad 1.88: 1 0,0; 2 2.54,0
SCREWTERMINAL-3.5MM-2@1 = drill 1.2 pad 2.032 square: 1 0,0 | drill 1.2 pad 2.032: 2 3.5,0
POWER_JACK_PTH = drill 2.997 pad 4.318: GND 0,7.7; GNDBREAK 4.7,10.7; PWR 0,13.7
SON50P200X300X60-10 = smd 1.16 x 0.26: 1 -0.785,1 | smd 1.01 x 0.26: 2 -0.86,0.5; 3 -0.86,0; 4 -0.86,-0.5; 5 -0.86,-1; 6 0.86,-1; 7 0.86,-0.5; 8 0.86,0; 9 0.86,0.5; 10 0.86,1
QFN14 = smd 0.85 x 0.28: 1 -1.725,-0.75; 7 1.725,-0.75; 8 1.725,0.75; 14 -1.725,0.75 | smd 0.28 x 0.85: 2 -1,-1.725; 3 -0.5,-1.725; 4 0,-1.725; 5 0.5,-1.725; 6 1,-1.725; 9 1,1.725; 10 0.5,1.725; 11 0,1.725; 12 -0.5,1.725; 13 -1,1.725 | smd 2 x 2: TH_PAD 0,0
SEPS_BB = drill 1.016 pad 1.88: 5V -6.35,-30.48; AREF -19.05,17.78; BUTTON1 15.24,17.78; BUTTON2 12.7,17.78; BUTTON3 10.16,17.78; BUTTON4 7.62,17.78; DIO1-RESET -11.43,-30.48; GND -3.81,-30.48; GND@1 -1.27,-30.48; GND@2 -16.51,17.78; LED1 5.08,17.78; LED2 2.54,17.78; LED3 -1.27,17.78; LED4 -3.81,17.78; NC 1.27,-30.48; PO.03 6.35,-30.48; PO.04 8.89,-30.48; PO.11 20.32,17.78; PO.12 17.78,17.78; PO.22(CTS)-DIO18(RTS) -6.35,17.78; PO.23(RTS)-DIO19(CTS) -8.89,17.78; PO.24(TX)-DIO2(RX) -11.43,17.78; PO.25(RX)-DIO3(TX) -13.97,17.78; PO.28 11.43,-30.48; PO.29 13.97,-30.48; PO.30 16.51,-30.48; PO.31 19.05,-30.48; SCL_FG -24.13,17.78; SDA_FG -21.59,17.78; VDD -16.51,-30.48; VDD@1 -13.97,-30.48; VDD@2 -8.89,-30.48
1X01 = drill 1.016 pad 1.88: 1 0,0

### Placement (x,y rotation side)
AE  53.22,19.66 270 top
AND  52.01,49.84 180 top
BAT3  11.38,23.29 0 top
BATD/CD  13.29,19.71 180 top
BATT  4.27,15.11 90 top
BATT_TEST  7.82,13.82 90 top
BOOST  51.54,13.58 180 top
C1  17.08,29.31 270 top
C2  23.16,28.84 270 top
C3  31.09,14.85 90 top
C8  59.24,23.97 180 top
C9  59.24,21.33 180 top
C12  26.6,22.92 90 top
C14  60.54,33.64 270 bottom
C15  60.22,37.13 270 top
C16  60.19,40.73 90 top
C18  18.54,34.01 270 top
C19  15.45,33.7 270 top
C20  32.16,17.77 180 top
C21  49.38,8.98 0 top
C22  39.67,19.79 0 top
C23  48.95,23.42 0 top
C24  65.65,46.33 90 top
C25  51.08,43.8 0 bottom
C26  51.13,46.23 0 bottom
CHG  64.48,8.46 0 top
D1  54.83,11.08 180 top
D5  60.67,14.08 0 top
FT230XQ-R  58.47,46.93 0 top
J2  69.78,39.18 90 top
L1  62.58,36.26 0 bottom
L2  26.83,25.87 0 top
LCE  43.79,25.7 180 top
LX  56.51,16.16 270 top
MAX17710  49.11,19.6 90 top
PCKP  42.66,17.79 0 top
Q1  57.77,31.3 270 top
R1  27.45,17.49 0 top
R2  31.67,7.77 0 bottom
R3  52.29,7.78 270 top
R6  68.72,46.35 270 top
R7  39.58,22.96 180 top
R8  33.92,22.99 0 top
R10  35.98,9.73 90 top
R13  52.24,22.99 0 top
R14  48.72,25.81 180 top
R15  36.65,49.63 0 top
R16  40.42,49.69 180 top
R17  29.12,11.01 270 top
R18  15.63,17.53 180 top
R19  21.4,17.44 180 top
R21  14.75,29.36 90 top
R22  17.1,24.83 90 top
R23  57.25,37.58 0 top
R24  55.62,28.37 180 top
R25  53.77,32.42 270 top
R26  50.97,36.52 0 top
R27  68.89,49.79 0 top
R28  65.14,50.08 0 top
R29  57.29,40.62 180 top
RB2  4.7,26.04 180 top
RCG  13.63,13.08 90 top
REG_OUT  18.49,42.13 90 top
RTPS1  21.1,20.7 0 top
RTPS2  23.88,20.74 270 top
RTPS3  17.58,20.97 90 top
RX  61.42,56.65 180 top
RX_TX  64.53,23.31 270 top
SCL  15.91,53.74 0 top
SCL_SDA  46.66,49.63 180 top
SDA  8.01,53.74 180 top
SOLAR  34.76,27.55 0 top
SOLAR_CON  2.87,38.94 90 bottom
SOLAR_JACK  -2.97,29.5 270 top
STC3115  23.59,13.17 180 top
TPS62737  21.16,24.28 270 top
TX  66.85,56.55 0 top
U$1  48.01,35.56 0 top
VDD_CH  64.49,12.16 0 top

### Tracks (layer width: path | path; a pad name or v marks a point on that pad's centre or on a via)
ALM_FG  (via drill 0.47)
  Top 0.27: v26.07,11.86 25.75,12.17 STC3115.1 | v15.77,19.99 16.67,19.09 22.68,19.09 24.17,17.6 26.44,17.6 R1.1
  Bottom 0.254: 25.72,11.51 21.9,11.51 21.49,11.1 20.22,11.1 20.16,11.17
  Bottom 0.27: RB2.DIO22 18.8,54.07 17.64,55.23 4.62,55.23 4.08,54.69 4.08,48.29 15.77,36.6 v15.77,19.99 15.77,17.49 15.77,17.29 15.77,15.58 20.16,11.19 20.16,11.17 | v26.07,11.86 25.72,11.51
DIO1-RESET  (via drill 0.47)
  Top 0.27: v22.98,39.79 22.98,41.69 20.58,44.09 10.68,44.09 v10.18,43.59 | v36.68,11.93 35.98,11.23 R10.2
  Bottom 0.27: v36.68,11.93 29.78,18.83 29.78,31.69 22.98,38.49 v22.98,39.79 | v10.18,43.59 6.1,47.67 RB2.DIO1-RESET
DP4_UART_FTDI_TX  (via drill 0.47)
  Top 0.27: v63.19,46.39 63.19,47.78 60.27,50.69 58.64,50.69 58.14,50.2 FT230XQ-R.15 | RX_TX.1 64.53,35.81 64.83,36.11 64.83,36.14 v65.08,36.39
  Bottom 0.27: v65.08,36.39 65.08,44.5 v63.19,46.39
DP5_UART_FTDI_RX
  Top 0.27: FT230XQ-R.2 54.98,47.26 | AND.4 51.56,48.99 53.19,47.36 55.08,47.36 54.98,47.26 | 54.98,47.26 54.66,46.93 54.66,37.11 57.18,34.59 61.08,34.59 62.7,32.97 62.7,21.29 63.23,20.77 RX_TX.2
GND  (via drill 0.47, 0.47 pad 0.25, 0.8)
  Top 0.27: v21.67,24.79 v21.67,24.78 21.97,24.78 TPS62737.12 23.52,24.79 24.38,24.79 | 25.71,15.4 25.25,14.94 25.25,14.26 25.16,14.17 24.58,14.17 STC3115.5 24.45,14.92 24.24,15.12 | 20.11,20.79 RTPS1.1 20.92,21.42 20.92,23.17 20.92,23.69 v20.69,23.92 | MAX17710.4 49.36,19.35 49.22,19.49 | 49.22,19.49 MAX17710.13 | 49.22,19.49 49.58,19.12 50.14,19.12 50.36,18.9 MAX17710.6
  Top 0.3: TPS62737.3 20.75,24.78
  Top 0.5: v59.08,47.59 59.08,48.04 59.45,48.41 FT230XQ-R.13 | FT230XQ-R.3 56.49,46.59 v57.78,46.59 58.12,46.93 FT230XQ-R.17 | 20.75,24.78 v20.77,24.8 | C12.2 25.85,23.82 24.88,24.79 24.38,24.79 | 20.11,20.79 v18.98,20.79 | MAX17710.13 48.86,19.6 v48.58,19.89 | TPS62737.14 21.91,24.84 21.97,24.78
  Top 1: C3.2 31.26,15.92 C20.2 | RCG.2 15.56,13.98 16.7,15.12 24.24,15.12 | 25.71,15.4 24.43,16.68 23.82,16.68 v23.77,16.73
  Bottom 1: v18.98,20.79 23.04,16.73 v23.77,16.73
  other vias: 58.88,10.29 33.44,38.99 13.68,42.19 21.68,23.88 49.68,19.89 38.27,38.99 41.82,38.48 43.86,35.18 45.13,38.48 46.9,41.53 46.65,45.34 54.27,56.01 49.19,56.01 26.33,56.51 12.87,56.51 2.45,56.01 2.71,49.4 4.49,35.69 4.23,21.46 3.47,15.11 1.18,4.7 1.44,1.65 3.98,1.14 19.22,1.14 38.01,1.14 39.28,8 44.87,8.25 64.68,2.41 69,3.43 69.51,11.56 69.51,19.18 69.51,29.34 70.53,47.88 40.55,28.57 31.66,32.64 22.01,32.89 17.19,27.05 45.89,23.49 42.59,11.81 41.82,9.52 38.52,26.54 31.92,56.51 69.51,15.11
  pour Top: 71.28,57.79 0.88,57.79 0.88,0.99 71.28,0.99
  pour Bottom: 71.28,57.99 0.68,57.99 0.68,0.89 71.28,0.89
GPIO1
  Top 0.27: U$1.PO.03 52.89,3.61 4.38,3.61 4.38,6.79 5.21,7.62 RB2.NC@3
GPIO2
  Top 0.27: RB2.NC@2 8.64,8.83 8.5,8.97 4.58,8.97 3.8,8.19 3.8,3.09 54.91,3.09 U$1.PO.04
GPIO3
  Top 0.27: RB2.NC@1 11.18,9.09 10.68,9.59 3.58,9.59 2.88,8.89 2.88,2.61 56.97,2.61 U$1.PO.28
GPIO4
  Top 0.27: RB2.NC 13.72,9.45 12.98,10.19 2.48,10.19 2.3,10.01 2.3,2.16 2.43,2.04 58.94,2.04 U$1.PO.29
N$1  (via drill 0.47)
  Top 0.27: v61.63,48.06 60.83,47.26 FT230XQ-R.11
  Top 0.5: v62.28,50.89 62.98,50.18 64.14,50.18 R28.1
  Bottom 0.5: v62.28,50.89 62.28,48.71 v61.63,48.06
N$2  (via drill 0.8)
  Top 0.5: 65.38,37.58 65.52,37.72 65.89,37.72 66.05,37.88 J2.1
  Top 1: v63.6,37.58 65.38,37.58
  Bottom 1: C14.1 62.14,34.54 63.48,35.88 L1.1 63.48,37.46 v63.6,37.58
N$3
  Top 0.27: Q1.1 55.7,33.32 R25.1 53.77,33.62 53.47,33.62 51.87,35.23 | R26.2 51.87,35.86 51.87,35.23 | 51.87,35.23 51.58,34.94 50.35,34.94 50.35,30.84 56.58,24.62 56.57,24.62 57.21,23.97 C8.2
N$4
  Top 0.27: RTPS2.1 22.82,21.64 TPS62737.8 22,22.47 RTPS1.2
N$5  (via drill 0.47)
  Top 0.27: v18.38,17.59 16.59,17.59 R18.1 | STC3115.8 21.69,13.17 20.76,12.24 v20.24,12.24
  Bottom 0.27: v20.24,12.24 arc-90 19.18,13.3 19.18,16.79 v18.38,17.59
N$6
  Top 0.27: R22.1 17.25,23.78 TPS62737.5
N$7
  Top 0.27: 50.12,16 50.12,17.13 49.86,17.39 MAX17710.5 | D1.C 54.86,12.2 50.4,12.2 50.4,13.56 BOOST.2 50.38,15.01 50.38,15.26
  Top 0.5: 50.12,16 50.38,15.74 50.38,15.38 50.38,15.26 | LX.2 56.26,15.26
  Top 1: 56.26,15.26 50.38,15.26
N$9  (via drill 0.47)
  Top 0.27: MAX17710.3 48.86,17.14 v49.15,16.84 | v42.53,21.69 39.04,21.69 38.68,22.05 38.68,22.79 R7.2
  Top 0.5: 38.68,22.79 37.48,21.59 33.82,21.59 33.03,22.39 R8.1 31.53,24.49 31.53,29.29 29.29,31.52 19.18,31.52 C19.2
  Bottom 0.27: v42.53,21.69 47.37,16.84 v49.15,16.84
N$10
  Top 0.27: R21.1 14.75,23.51 15.48,22.79 18.94,22.79 TPS62737.6
N$11  (via drill 0.47)
  Top 0.27: TPS62737.13 23.08,25.28 23.08,25.38 | 23.08,25.38 23.78,25.38 | TPS62737.2 18.58,26.14 v18.58,27.79 | 23.08,25.38 23.08,26.07 v23.49,26.48
  Top 0.5: 23.78,25.38 24.27,25.87 L2.P$1
  Bottom 0.27: v18.58,27.79 22.18,27.79 v23.49,26.48
N$12
  Top 0.27: SCL.1 11.58,53.74 RB2.SCL_FG
N$13
  Top 0.27: MAX17710.10 48.86,21.91 48.05,22.72 C23.1 48.05,24.12 48.62,24.69 49.13,24.69 49.62,25.18 R14.1
N$14  (via drill 0.47)
  Top 0.27: v56.58,43.99 57.49,44.91 FT230XQ-R.5 | R27.1 66.68,48.48 v64.77,48.48
  Bottom 0.27: v56.58,43.99 56.58,44.59 | 56.58,44.59 | 56.58,44.59 | 56.58,44.59 56.58,44.99 57.18,45.59 59.38,45.59 59.88,46.09 59.88,46.89 60.9,46.89 61.18,47.17 63.34,47.17 64.65,48.48 v64.77,48.48
N$15
  Top 0.2: LCE.2 43.79,22.48
  Top 0.27: 43.79,22.48 44.31,21.96 48.07,21.96 48.36,21.68 MAX17710.11
N$16
  Top 0.27: MAX17710.8 49.88,21.07 49.88,21.77 51.1,22.99 R13.1
N$17
  Top 0.27: LCE.1 47.7,25.7 R14.2
N$18
  Top 0.27: R6.2 67.46,44.19 64.98,44.19 arc90 63.78,42.99 63.78,41.09 arc90 65.03,39.83 J2.4
N$19
  Top 0.27: 52.37,19.66 50.98,21.05 MAX17710.7 | 52.37,19.66 | 52.37,19.66 | AE.2 52.37,19.66
N$20  (via drill 0.47)
  Top 0.27: RX.C arc90 60.5,56.69 58.98,56.69 arc90 58.68,56.39 v58.68,55.59 | v69.65,55.59 69.65,55.49 70.15,54.99 70.15,51.65 69.68,51.18 67.14,51.18 R28.2
  Bottom 0.27: v69.65,55.59 v58.68,55.59
N$21
  Top 0.27: R10.1 35.98,5.68 U$1.DIO1-RESET
N$22
  Top 0.27: TPS62737.7 19.72,21.87 RTPS3.2
N$23
  Top 0.27: SDA.3 7,51.7 RB2.SDA_FG
N$24
  Top 0.27: R27.2 69.79,50.59 70.62,51.42 70.62,56.06 70.13,56.55 TX.C
N$25
  Top 0.2: 13.3,18.67 13.3,19.7
  Top 0.27: R18.2 14.44,17.53 13.3,18.67 | 13.3,19.7 BATD/CD.2
N$26
  Top 0.27: TPS62737.9 24.18,23.28 25.28,22.19 25.28,19.84 RTPS2.2 22.88,19.84 22.6,19.57 18.98,19.57 18.48,20.07 RTPS3.1
N$27
  Top 0.27: SDA.1 10.43,55.14 25.05,55.14 26.42,53.77 U$1.SDA_FG
N$28
  Top 0.27: SCL.3 23.47,53.74 U$1.SCL_FG
N$29
  Top 0.27: BAT3.1 14.31,20.36 BATD/CD.1 14.92,19.71 16.04,18.59 21.48,18.59 22.3,17.76 R19.1
N$30  (via drill 0.47)
  Top 0.27: 48.36,15.92 MAX17710.2 | C21.1 48.36,9.11 | 48.36,11.01 48.36,12.12 | 58.79,13.58 59.28,14.08 59.59,14.08 D5.1 60.08,11.99 63.61,8.45 CHG.1
  Top 1: v57.2,11.99 58.79,13.58 BOOST.1 | 48.36,12.12 48.36,15.92
  Top 1.5: 48.36,9.11 48.36,12.12 | 48.36,11.01 51.12,11.01 v51.24,11.13
  Bottom 1: v57.2,11.99 56.73,12.46 52.94,12.46 51.62,11.13 v51.24,11.13
N$31
  Top 0.175: FT230XQ-R.7 58.79,45.26 58.4,45.65 57.13,45.65 56.57,45.09
  Top 0.27: 56.57,45.09 55.67,45.09 55.38,44.79 55.38,39.09 arc65 R23.1
N$32
  Top 0.27: R29.2 56.39,41.9 56.68,42.19 arc90 58.14,43.66 FT230XQ-R.6
N$33  (via drill 0.47)
  Top 0.27: v55.48,49.59 56.84,49.59 FT230XQ-R.16 | v53.88,46.59 53.98,46.49 53.98,36.89 56.88,33.99 60.28,33.99 61.98,32.29 61.98,18.98 62.73,18.23 RX_TX.3
  Bottom 0.27: v53.88,46.59 53.88,47.99 v55.48,49.59
N$34  (via drill 0.47)
  Top 0.27: v24.92,10.77 24.13,10.77 STC3115.10 | C3.1 31.02,13.89 v29.68,13.89
  Top 0.5: v27.44,9.76 27.79,10.11 R17.2 31.09,10.11 v31.18,10.03
  Bottom 0.27: v31.18,10.03 31.18,11.93 29.68,13.43 v29.68,13.89
  Bottom 0.5: v27.44,9.76 25.93,9.76 v24.92,10.77
N$35  (via drill 0.47)
  Top 0.27: v53.18,44.99 53.18,36.79 56.68,33.29 59.48,33.29 61.28,31.49 61.28,17.14 62.73,15.69 RX_TX.4 | v55.42,45.95 FT230XQ-R.4
  Bottom 0.27: v53.18,44.99 54.46,44.99 v55.42,45.95
N$36
  Top 0.27: R3.1 53.69,10.08 53.69,11.07 D1.A
NO_SIGNAL
  cutout Bottom: 43.68,41.89 43.68,40.69 22.28,40.69 22.28,44.49 43.68,44.49
  cutout Bottom: 68.18,34.59 62.98,34.59 62.98,26.39 68.48,26.39 68.48,34.59
PO.22(CTS)-DIO18(RTS)  (via drill 0.47)
  Top 0.27: RB2.PO.22(CTS)-DIO18(RTS) 18.8,8.84 v17.8,9.84 | v14.78,36.19 16.18,37.59 28.38,37.59 35.86,45.07 v35.86,45.11
  Bottom 0.27: v14.78,36.19 14.78,36.79 12.28,39.29 12.18,39.29 arc90 11.48,38.59 11.48,36.39 13.36,34.51 13.36,21.39 11.78,21.39 10.98,20.59 10.98,12.69 12.58,11.09 16.55,11.09 v17.8,9.84 | v35.86,45.11 35.86,46.53 40.89,51.57 40.89,51.56 41.66,52.32 U$1.PO.22(CTS)-DIO18(RTS)
PO.23(RTS)-DIO19(CTS)  (via drill 0.47)
  Top 0.27: v34.48,45.29 27.78,38.59 13.38,38.59 v12.48,37.69 | v20.69,9.85 20.69,8.26 RB2.PO.23(RTS)-DIO19(CTS)
  Bottom 0.27: U$1.PO.23(RTS)-DIO19(CTS) 37.55,51.77 36.36,51.77 34.48,49.89 v34.48,45.29 | v12.48,37.69 12.74,37.69 14,36.43 14,16.57 20.69,9.87 v20.69,9.85
PO.24(TX)-DIO2(RX)
  Top 0.27: U$1.PO.24(TX)-DIO2(RX) 38.33,51.59 51.78,51.59 52.01,51.35 AND.2
  Bottom 0.27: U$1.PO.24(TX)-DIO2(RX) 35.03,54.89 22.88,54.89 21.34,53.35 RB2.PO.24(TX)-DIO2(RX)
PO.25(RX)-DIO3(TX)
  Top 0.27: U$1.PO.25(RX)-DIO3(TX) 35.69,54.99 46.96,54.99 49.89,52.06 52.1,52.06 52.66,51.5 AND.1
  Bottom 0.27: RB2.PO.25(RX)-DIO3(TX) 24.72,51.64 25.15,52.07 32.78,52.07 U$1.PO.25(RX)-DIO3(TX)
PWR_EN#  (via drill 0.47)
  Top 0.27: v60.06,49.82 58.82,49.82 58.82,49.72 58.79,49.72 FT230XQ-R.14 | R26.1 50.07,46.18 v51.58,47.69
  Bottom 0.27: v51.58,47.69 54.38,50.49 59.39,50.49 v60.06,49.82
RCG
  cutout Top: 13.54,13.42 15.95,13.42 17.05,14.52 24.14,14.52 24.14,13.96 24.16,13.98 24.83,13.98 24.83,15.49 24.79,15.53 24.51,15.81 16.49,15.81 15.32,14.64 12.7,14.64 12.7,13.42
RSTIO_FG
  Top 0.27: RB2.RESET 16.26,11.35 17.92,13.02 20.82,13.02 21.48,13.67 22.63,13.67 STC3115.7
  Bottom 0.27: RB2.RESET 16.26,7.97 17.28,8.99 29.55,8.99 R2.2
SCL_FG  (via drill 0.47)
  Top 0.27: SCL_SDA.2 42.85,50.95 36.82,50.95 35.75,49.89 R15.1 34.63,49.63 32.21,52.06 17.11,52.06 15.91,53.25 SCL.2 | STC3115.3 25.46,13.17 26.16,13.87 v26.16,14.14 | v15.58,45.49 16.14,46.05 40.34,46.05 41.48,47.19 v41.68,47.19
  Bottom 0.27: v15.58,45.49 15.58,45.19 16.68,44.09 16.68,35.79 21.78,30.69 21.78,29.29 26.98,24.09 26.98,14.96 v26.16,14.14 | SCL_SDA.2 v41.68,47.19
SDA_FG  (via drill 0.47)
  Top 0.27: SCL_SDA.1 44.46,47.43 43.58,47.43 R16.1 41.33,48.06 39.8,46.54 5.53,46.54 | 5.53,46.54 4.58,47.5 4.58,54.49 5.28,55.19 7.58,55.19 8.01,54.75 SDA.2 | STC3115.2 26.27,12.67 v26.77,13.17 | v20.88,41.59 19.58,40.29 11.79,40.29 5.53,46.54
  Bottom 0.27: v20.88,41.59 20.88,39.79 29.18,31.49 29.18,17.89 28.17,16.88 28.17,14.57 v26.77,13.17
STC
  cutout Top: 23.32,14.48 23.32,11.91 23.39,11.84 23.42,11.81 23.73,11.81 23.75,11.84 23.75,12.5 23.75,13.87 23.9,14.02 23.9,14.48 23.88,14.5 23.34,14.5
USBD_N
  Top 0.27: R23.2 59.77,37.58 C15.1 61.73,38.03 62.24,38.53 J2.2
USBD_P
  Top 0.27: J2.3 62.4,39.18 62.01,39.57 62.02,39.57 61.76,39.83 C16.1 59.41,40.62 R29.1
V_SOLAR
  Top 1.5: C18.1 15.76,34.91 C19.1 12.27,34.6 11.38,35.49 | 48.47,30.95 56.51,22.91 LX.1 | R8.2 34.83,23.09 34.84,23.1 34.84,27.48 SOLAR.1
  Top 2: 19.22,35.59 C18.1
  Top 3: SOLAR.1 34.75,27.56 34.75,35.11 34.27,35.59 | 19.22,35.59 32.89,35.59 34.27,35.59 | SOLAR_CON.2 4.43,42.44 11.38,35.49 10.73,34.84 SOLAR_JACK.PWR | 34.27,35.59 36.69,35.59 41.32,30.95 48.47,30.95
VBAT  (via drill 0.35, 0.47, 0.6, 0.65, 2)
  Top 0.27: 47.14,18.15 MAX17710.1 | AE.3 53.22,17.65
  Top 0.3: STC3115.9 22.11,12.67 21.25,11.8
  Top 0.5: 21.25,11.8 20.73,11.29 20.48,11.29 20.23,11.04 | v52.58,17.01 53.22,17.65
  Top 0.7: v12.08,16.29 13.02,16.29 18.55,16.29 19.7,17.44 R19.2
  Top 1: BATT.2 7.82,16.26 BATT_TEST.2 | 33.59,12.52 29.73,12.52 R17.1 27.9,11.91 25.53,9.54 22.93,9.54 21.44,11.03 21.44,11.04 20.23,11.04 | v12.08,16.29 13.02,16.29 13.04,16.29 v14.07,15.26 | 20.23,11.04 20.05,11.04 19.16,10.15 v17.81,11.51 | 20.23,11.04 | 44.04,15.05 47.14,18.15
  Top 2: C20.1 33.84,17.77 36.56,15.05 | v12.08,16.29 12,16.37 8.22,16.37 BATT.2 | 36.56,15.05 44.04,15.05 44.05,15.05 v45.98,13.12 | 33.59,12.52 36.12,15.05 36.56,15.05
  Bottom 1: v12.08,16.29 12.15,16.36 12.96,16.36 v17.81,11.51 v19.12,10.19
  Bottom 2: v45.98,13.12 48.69,13.12 v52.58,17.01
VBAT-
  Top 0.27: STC3115.6 20.78,14.16
  Top 0.5: 20.48,13.86 20.78,14.16
  Top 1: BATT_TEST.1 7.82,13.97 BATT.1 | RCG.1 15.75,12.18 17.43,13.86 20.48,13.86
  Top 1.5: 9.9,12.18 BATT.1
  Top 2: RCG.1 9.9,12.18
VCC_FTDI  (via drill 0.47)
  Top 0.27: FT230XQ-R.10 61.31,46.61
  Top 0.813: 61.31,46.61 v62.5,45.42
  Top 1: R25.2 55.6,31.52 56.01,31.12 Q1.2 | v51.18,31.99 51.65,31.52 R25.2 | R24.2 53.77,29.32 R25.2
  Bottom 1: v61.59,46.33 v62.5,45.42 62.53,45.39 60.71,43.58 | C26.1 52.03,43.85 C25.1 54.01,43.8 55.05,42.76 59.89,42.76 60.71,43.58 | 60.71,43.58 61.68,42.61 L1.2 55.45,36.26 v51.18,31.99
VCCIO_FTDI
  Top 0.27: TX.A 66.11,56.42 66.11,55.36 66.68,54.79 69.48,54.79 arc-90 69.68,54.59 69.68,52.27 arc-90 69.26,51.85
  Top 0.5: FT230XQ-R.1 55.64,47.91 54.64,48.91 | AND.5 54.56,48.99 54.64,48.91 | 59.98,51.85 69.26,51.85 | C24.1 63.91,45.43 | FT230XQ-R.8 FT230XQ-R.9 62.04,44.39 62.86,44.39 63.91,45.43 | 59.98,51.85 64.11,47.73 64.11,45.63 63.91,45.43 | 59.98,51.85 59.58,51.85 59.18,51.85 55.64,51.85 54.54,50.75 54.54,49.01 54.64,48.91
  Top 1: RX.A 65.88,56.65 TX.A
VDD  (via drill 0.35, 0.47)
  Top 0.27: 24.48,23.89 24.08,23.89 23.68,24.28 TPS62737.11
  Top 0.5: 36.98,47.66 37.55,48.24 R15.2 | R16.2 39.46,49.63 | C12.1 24.73,23.89 24.48,23.89
  Top 1: R15.2 39.46,49.63 | v29.7,16.6 29.24,16.6 R1.2 28.35,21.79 28.15,21.99 | v25.68,27.89 26.98,27.89 27.83,27.04 L2.P$2 27.83,25.37 28.15,25.05 28.15,21.99 | C12.1 28.12,22.02 28.15,21.99
  Top 1.5: 36.98,47.66 34.77,47.66 31.53,50.9 29.06,50.9 RB2.VDD
  Bottom 1: U$1.VDD U$1.VDD@1 34.01,5.11 R2.1 32.57,13.73 v29.7,16.6 | v27.02,27.88 27.01,27.89 v25.68,27.89
  Bottom 1.5: RB2.VDD 29.47,50.8 31.08,49.19 31.08,45.59 30.78,45.29 18.42,45.29 18.42,42.2 REG_OUT.1 18.49,39.33 25.68,32.14 v25.68,27.89
VDD_CHARGER
  Top 0.27: R24.1 58.27,28.37 59.67,29.77 60.14,29.77
  Top 0.5: 61.38,12.16 60.99,12.54 D5.2 60.99,15.37 60.14,16.22 C9.1 C8.1 60.14,29.77 60.14,30.03 Q1.3
  Top 1: 61.38,12.16 VDD_CH.1
VDD_DCDC
  Top 0.27: 47.04,21.05 MAX17710.12
  Top 1: TPS62737.1 20.41,28.21 | 47.04,21.05 43.78,17.79 PCKP.1
  Top 1.5: 20.41,28.21 21.94,29.74 C2.1 | C2.1 25.08,29.74 25.48,29.34 26.78,29.34 28.16,29.34 29.33,29.34 29.98,28.69 29.98,21.79 31.97,19.79 C22.1 38.77,18.39 39.46,17.7 42.58,17.7 PCKP.1 | R21.2 17.03,30.26 C1.1 22.69,30.21 C2.1

### Text on the board
tPlace: + | + | + | RTS | CTS | - | GPIO1 | GPIO2 | GPIO3 | GPIO4